# Altium schematic sheet Power.SchDoc
size A4
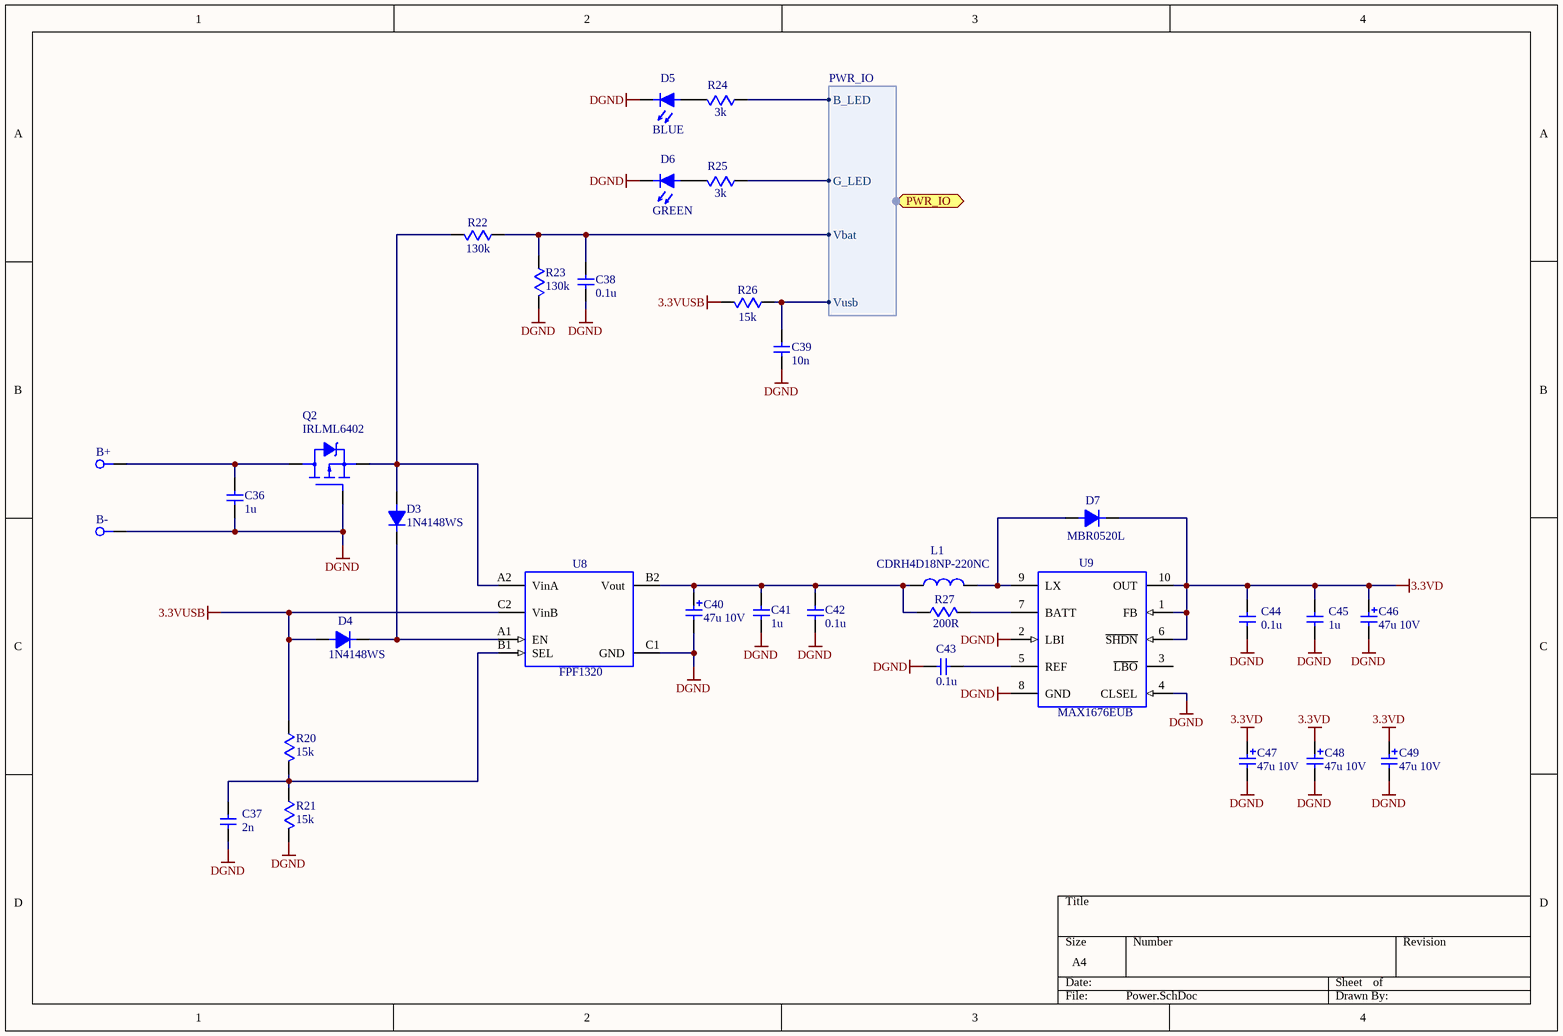
[diagram p0: Power.SchDoc]

## Parts
B+  TH HOLE  [1.0MM PAD]  (value not drawn)
B-  TH HOLE  [1.0MM PAD]  (value not drawn)
C36  1u  [SMD/C/0603]
C37  2n  [SMD/C/0603]
C38  0.1u  [SMD/C/0603]
C39  10n  [SMD/C/0603]
C40  47u 10V  [SMD/C/TAJ-B]
C41  1u  [SMD/C/0603]
C42  0.1u  [SMD/C/0603]
C43  0.1u  [SMD/C/0603]
C44  0.1u  [SMD/C/0603]
C45  1u  [SMD/C/0603]
C46  47u 10V  [SMD/C/TAJ-B]
C47  47u 10V  [SMD/C/TAJ-B]
C48  47u 10V  [SMD/C/TAJ-B]
C49  47u 10V  [SMD/C/TAJ-B]
D3  1N4148WS  [SMD/SOD-323]
D4  1N4148WS  [SMD/SOD-323]
D5  BLUE  [SMD/LED/0603]
D6  GREEN  [SMD/LED/0603]
D7  MBR0520L  [SMD/SOD-123]
L1  CDRH4D18NP-220NC  [SMD\L\SUMIDA\CDRH4D18]
Q2  IRLML6402  [SMD/SOT23]
R20  15k  [SMD/R/0603]
R21  15k  [SMD/R/0603]
R22  130k  [SMD/R/0603]
R23  130k  [SMD/R/0603]
R24  3k  [SMD/R/0603]
R25  3k  [SMD/R/0603]
R26  15k  [SMD/R/0603]
R27  200R  [SMD/R/0603]
U8  FPF1320  [SMD/BGA6/1.46x0.96MM/0.5MMP/0.25MMBALL/0.625MMH]
U9  MAX1676EUB  [SMD/SOP10/0.5MMP/3x3MM/4.9MMWP]

## Ports
PWR_IO (harness PWR_IO)

## Harnesses
PWR_IO: Vbat, Vusb, B_LED, G_LED

## Nets
3.3VD: C44.2 C45.2 C46.P C47.P C48.P C49.P D7.C U9.1(FB) U9.6(~{SHDN}) U9.10(OUT)
3.3VUSB: D4.A R20.1 R26.2 U8.C2(VinB)
DGND: B-.1 C36.1 C37.1 C38.1 C39.1 C40.M C41.1 C42.1 C43.2 C44.1 C45.1 C46.M C47.M C48.M C49.M D5.C D6.C Q2.1(G) R21.2 R23.2 U8.C1(GND) U9.2(LBI) U9.4(CLSEL) U9.8(GND)
NetB+_1: B+.1 C36.2 Q2.3(D)
NetC37_2: C37.2 R20.2 R21.1 U8.B1(SEL)
NetC38_2: C38.2 R22.1 R23.1 ; port PWR_IO.Vbat
NetC39_2: C39.2 R26.1 ; port PWR_IO.Vusb
NetC40_P: C40.P C41.2 C42.2 L1.1 R27.1 U8.B2(Vout)
NetC43_1: C43.1 U9.5(REF)
NetD3_A: D3.A Q2.2(S) R22.2 U8.A2(VinA)
NetD3_C: D3.C D4.C U8.A1(EN)
NetD5_A: D5.A R24.2
NetD6_A: D6.A R25.2
NetD7_A: D7.A L1.2 U9.9(LX)
NetR24_1: R24.1 ; port PWR_IO.B_LED
NetR25_1: R25.1 ; port PWR_IO.G_LED
NetR27_2: R27.2 U9.7(BATT)

Not connected (* = marked no-connect by the designer): U9 3(~{LBO})

## Library data of the parts
C36-C39 C41-C45 = Capacitor
  C36 C41 C45: Value: 1u
  C37: Value: 2n
  C38 C42-C44: Value: 0.1u
  C39: Value: 10n
C40 C46-C49 = Capacitor Pol: Value: 47u 10V
D3 D4 D7 = Diode
  D3 D4: Value: 1N4148WS
  D7: Value: MBR0520L
D5 D6 = LED: d3mm Ultra Brightness Blue LED
  D5: Value: BLUE
  D6: Value: GREEN
L1 = CDRH4D: Value: CDRH4D18NP-220NC
Q2 = IRLML6402: P-channel HEXFET Power MOSFET; Value: IRLML6402
R20-R27 = Resistor
  R20 R21 R26: Value: 15k
  R22 R23: Value: 130k
  R24 R25: Value: 3k
  R27: Value: 200R
U8 = FPF1320: Power Switch; Value: FPF1320
U9 = MAX1676EUB: High-Efficiency, Low-Supply-Current, Compact, Step-Up DC-DC Converters; Value: MAX1676EUB
B+ B- = TH HOLE: Value: TH HOLE